# EAGLE schematic ServoEncoder (EAGLE 8.2.1)
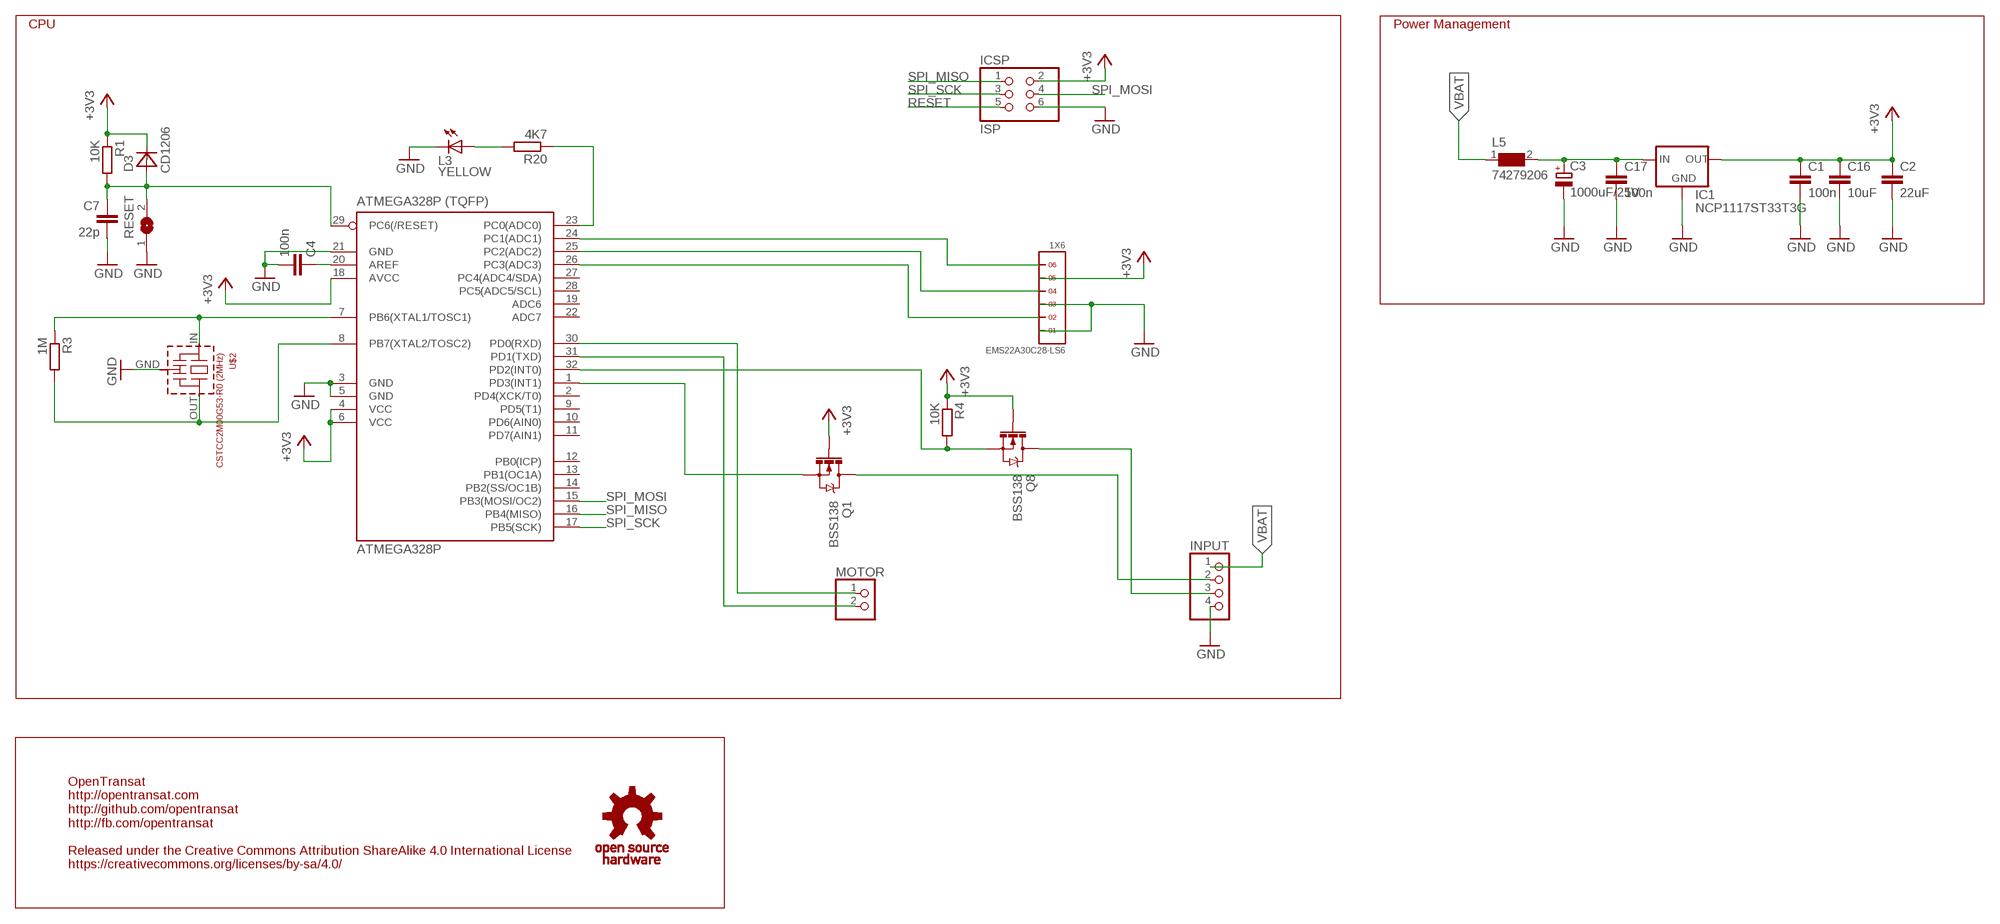
[diagram p0: schematic, sheet 1]

## Parts
ATMEGA328P  ATMEGA328P (TQFP)  MEGA8-AI  [TQFP32-08]
C1  100n  C-EUC0603  [C0603]
C2  22uF  C-EUC1210  [C1210]
C3  1000uF/25V  CPOL-EUE5-10.5  [E5-10,5]
C4  100n  C-EUC0603  [C0603]
C7  22p  C-EUC0603  [C0603]
C16  10uF  C-EUC1206  [C1206]
C17  100n  C-EUC0603  [C0603]
D3  CD1206  [R1206]
EMS22A30C28-LS6  1X6  [1X6]
IC1  NCP1117ST33T3G  LM1117MP-3.3  [SOT223]
ICSP  ISP  PINHD-2X3  [2X03]
INPUT  PINHD-1X4  [1X04]
L3  YELLOW  LEDCHIPLED_0805  [CHIPLED_0805]
L5  74279206  WE-CBF_0805  [0805]
MOTOR  PINHD-1X2  [1X02]
Q1  BSS138  MOSFET-NCHANNEL_SOT23-3  [SOT23-3]
Q8  BSS138  MOSFET-NCHANNEL_SOT23-3  [SOT23-3]
R1  10K  R-EU_R0603  [R0603]
R3  1M  R-EU_R0603  [R0603]
R4  10K  R-EU_R0603  [R0603]
R20  4K7  R-EU_R0603  [R0603]
RESET  SJW  [SJW]
U$1  OSHW_S  [OSHWS]
U$2  CSTCC2M00G53-R0 (2MHz)  CSTCC  [CSTCC]

## Nets
+3V3: ATMEGA328P.4(VCC) ATMEGA328P.6(VCC) ATMEGA328P.18(AVCC) C1.1 C2.1 C16.1 D3.2(C) EMS22A30C28-LS6.5 IC1.2(OUT) IC1.4(OUT) ICSP.2 Q1.1(G) Q8.1(G) R1.1 R4.1
AREF: ATMEGA328P.20(AREF) C4.1
GND [GND]: ATMEGA328P.3(GND) ATMEGA328P.5(GND) ATMEGA328P.21(GND) C1.2 C2.2 C3.- C4.2 C7.2 C16.2 C17.2 EMS22A30C28-LS6.1 EMS22A30C28-LS6.3 IC1.1(GND) ICSP.6 INPUT.4 L3.C RESET.1 U$2.GND
L13: ATMEGA328P.23(PC0(ADC0)) R20.1
N$1: C3.+ C17.1 IC1.3(IN) L5.2
N$2: INPUT.3 Q8.3(D)
N$3: ATMEGA328P.30(PD0(RXD)) MOTOR.1
N$4: L3.A R20.2
N$5: ATMEGA328P.31(PD1(TXD)) MOTOR.2
N$6: ATMEGA328P.1(PD3(INT1)) Q1.2(S)
N$7: ATMEGA328P.24(PC1(ADC1)) EMS22A30C28-LS6.6
N$8: ATMEGA328P.25(PC2(ADC2)) EMS22A30C28-LS6.4
N$9: ATMEGA328P.26(PC3(ADC3)) EMS22A30C28-LS6.2
N$10: INPUT.2 Q1.3(D)
N$11: ATMEGA328P.32(PD2(INT0)) Q8.2(S) R4.2
RESET: ATMEGA328P.29(PC6(/RESET)) C7.1 D3.1(A) ICSP.5 R1.2 RESET.2
SPI_MISO: ATMEGA328P.16(PB4(MISO)) ICSP.1
SPI_MOSI: ATMEGA328P.15(PB3(MOSI/OC2)) ICSP.4
SPI_SCK: ATMEGA328P.17(PB5(SCK)) ICSP.3
VBAT: INPUT.1 L5.1
XTAL1: ATMEGA328P.8(PB7(XTAL2/TOSC2)) R3.2 U$2.OUT
XTAL2: ATMEGA328P.7(PB6(XTAL1/TOSC1)) R3.1 U$2.IN
Unconnected: ATMEGA328P.2(PD4(XCK/T0)) ATMEGA328P.9(PD5(T1)) ATMEGA328P.10(PD6(AIN0)) ATMEGA328P.11(PD7(AIN1)) ATMEGA328P.12(PB0(ICP)) ATMEGA328P.13(PB1(OC1A)) ATMEGA328P.14(PB2(SS/OC1B)) ATMEGA328P.19(ADC6) ATMEGA328P.22(ADC7) ATMEGA328P.27(PC4(ADC4/SDA)) ATMEGA328P.28(PC5(ADC5/SCL))

## Notes on the sheet
- CPU | Power Management
- OpenTransat
  http://opentransat.com
  http://github.com/opentransat
  http://fb.com/opentransat
  
  Released under the Creative Commons Attribution ShareAlike 4.0 International License
  https://creativecommons.org/licenses/by-sa/4.0/

## Library data of the parts
ATMEGA328P = atmel:MEGA8: MICROCONTROLLER 8 Kbytes FLASH, 1 kbytes SRAM, 512 bytes EEPROM, USART, 6-channel 10 bit ADC, 2-channel 8 bit ADC Pin compatible with Atmega48, ATMega88, ATMega168 Source: avr.lbr; MPN: ATMEGA8-16AU; OC_FARNELL: 9171371; OC_NEWARK: 73M8863
C1 C2 C4 C7 C16 C17 = rcl:C-EU: CAPACITOR, European symbol
C3 = transducer:CPOL-EU: POLARIZED CAPACITOR, European symbol
D3 = diodes_smd:CD1206
EMS22A30C28-LS6 = headers(2mm):1X6
IC1 = lm1117_10:LM1117?-*: 800mA Low-Dropout Linear Regulator Source: http://www.ti.com/lit/ds/symlink/lm1117-n.pdf; MF: Texas Instruments; MPN: LM1117MP-3.3; OC_FARNELL: 9778195; OC_NEWARK: 28X3416
ICSP = pinhead:PINHD-2X3: PIN HEADER
INPUT = pinhead:PINHD-1X4: PIN HEADER
L3 = led:LED: LED OSRAM: - CHIPLED LG R971, LG N971, LY N971, LG Q971, LY Q971, LO R971, LY R971 LH N974, LH R974 LS Q976, LO Q976, LY Q976 LO Q996 - Hyper CHIPLED LW Q18S LB Q993, LB Q99A, LB R99A - SideLED LS A670, LO A670, LY A670, LG A670, LP A670 LB A673, LV A673, LT A673, LW A673 LH A674 LY A675 LS A676, LA A676, LO A676, LY A676, LW A676 LS A679, LY A679, LG A679 - Hyper Micro SIDELED® LS Y876, LA Y876, LO Y876, LY Y876 LT Y87S - SmartLED LW L88C, LW L88S LB L89C, LB L89S, LG L890 LS L89K, LO L89K, LY L89K LS L896, LA L896, LO L896, LY L896 - TOPLED LS T670, LO T670, LY T670, LG T670, LP T670 LSG T670, LSP T670, LSY T670, LOP T670, LYG T670 LG T671, LOG T671, LSG T671 LB T673, LV T673, LT T673, LW T673 LH T674 LS T676, LA T676, LO T676, LY T676, LB T676, LH T676, LSB T676, LW T676 LB T67C, LV T67C, LT T67C, LS T67K, LO T67K, LY T67K, LW E67C LS E67B, LA E67B, LO E67B, LY E67B, LB E67C, LV E67C, LT E67C LW T67C LS T679, LY T679, LG T679 LS T770, LO T770, LY T770, LG T770, LP T770 LB T773, LV T773, LT T773, LW T773 LH T774 LS E675, LA E675, LY E675, LS T675 LS T776, LA T776, LO T776, LY T776, LB T776 LHGB T686 LT T68C, LB T68C - Hyper Mini TOPLED® LB M676 - Mini TOPLED Santana® LG M470 LS M47K, LO M47K, LY M47K Source: http://www.osram.convergy.de LUXEON: - LUMILED® LXK2-PW12-R00, LXK2-PW12-S00, LXK2-PW14-U00, LXK2-PW14-V00 LXK2-PM12-R00, LXK2-PM12-S00, LXK2-PM14-U00 LXK2-PE12-Q00, LXK2-PE12-R00, LXK2-PE12-S00, LXK2-PE14-T00, LXK2-PE14-U00 LXK2-PB12-K00, LXK2-PB12-L00, LXK2-PB12-M00, LXK2-PB14-N00, LXK2-PB14-P00, LXK2-PB14-Q00 LXK2-PR12-L00, LXK2-PR12-M00, LXK2-PR14-Q00, LXK2-PR14-R00 LXK2-PD12-Q00, LXK2-PD12-R00, LXK2-PD12-S00 LXK2-PH12-R00, LXK2-PH12-S00 LXK2-PL12-P00, LXK2-PL12-Q00, LXK2-PL12-R00 Source: www.luxeon.com KINGBRIGHT: KA-3528ASYC Source: www.kingbright.com
L5 = Wurth_Elektronik_Passive_rev15b:WE-CBF: SMD EMI Suppression Ferrite Beads WE-CBF - Excellent anti-EMI properties - Low DC-restistance - Impedances till 3000 ohms - Rated current up to 6 A -- Reliable Ni-Sn electrodes -- Perfect as data lined filter and for uncoupling of distribution voltage <http://katalog.we-online.de/media/images/eisos/FeCBF_pf2.jpg> Details see: http://katalog.we-online.de/en/pbs/WE-CBF updated by Dan Xu 2014-06-19 2014 (C) Würth Elektronik
MOTOR = pinhead:PINHD-1X2: PIN HEADER
Q1 Q8 = Simplex-DiscreteSemi:MOSFET-NCHANNEL: Generic N-channel mosfet
R1 R3 R4 R20 = rcl:R-EU_: RESISTOR, European symbol
RESET = jumper:SJ: SMD solder JUMPER
U$1 = oshw:OSHW_S
U$2 = murata-cstcc-cstcv-resonators:CSTCC: Murata CSTCC Resonator - 7,2 x 3,0 mm

## Net classes
1 power 5V: width 0.305 mm, drill 0.508 mm, clearance 0.203 mm
2 power 3.3V: width 0.305 mm, drill 0.508 mm, clearance 0.203 mm
3 GND: width 0.305 mm, drill 0.508 mm, clearance 0.203 mm
4 3A: width 1.372 mm, drill 0.635 mm, clearance 0.406 mm